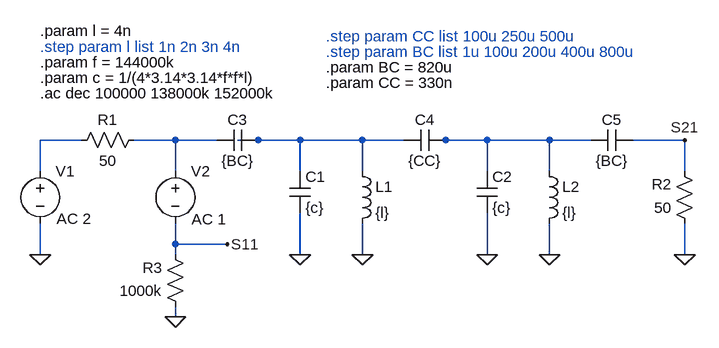
[diagram p0: schematic ece522p1.1.asc]
ece522p1.1.asc, the LTspice schematic file:
Version 4
SHEET 1 964 680
WIRE -240 112 -304 112
WIRE -96 112 -160 112
WIRE -32 112 -96 112
WIRE 32 112 0 112
WIRE 96 112 32 112
WIRE 192 112 96 112
WIRE 256 112 192 112
WIRE 320 112 304 112
WIRE 384 112 320 112
WIRE 480 112 384 112
WIRE 544 112 480 112
WIRE 688 112 608 112
WIRE -304 160 -304 112
WIRE -96 160 -96 112
WIRE 96 160 96 112
WIRE 192 160 192 112
WIRE 384 160 384 112
WIRE 480 160 480 112
WIRE 688 160 688 112
WIRE -96 272 -96 240
WIRE -16 272 -96 272
WIRE -304 288 -304 240
WIRE -96 288 -96 272
WIRE 96 288 96 224
WIRE 192 288 192 240
WIRE 384 288 384 224
WIRE 480 288 480 240
WIRE 688 288 688 240
WIRE -96 384 -96 368
WIRE -96 384 -112 384
FLAG -304 288 0
FLAG -96 384 0
FLAG 96 288 0
FLAG 192 288 0
FLAG 384 288 0
FLAG 688 288 0
FLAG 480 288 0
FLAG -16 272 S11
FLAG 688 112 S21
SYMBOL cap 80 160 R0
SYMATTR InstName C1
SYMATTR Value {c}
SYMBOL cap 368 160 R0
SYMATTR InstName C2
SYMATTR Value {c}
SYMBOL cap 32 96 R90
WINDOW 0 0 32 VBottom 2
WINDOW 3 32 32 VTop 2
SYMATTR InstName C3
SYMATTR Value {BC}
SYMBOL cap 320 96 R90
WINDOW 0 0 32 VBottom 2
WINDOW 3 32 32 VTop 2
SYMATTR InstName C4
SYMATTR Value {CC}
SYMBOL cap 608 96 R90
WINDOW 0 0 32 VBottom 2
WINDOW 3 32 32 VTop 2
SYMATTR InstName C5
SYMATTR Value {BC}
SYMBOL res -144 96 R90
WINDOW 0 0 56 VBottom 2
WINDOW 3 32 56 VTop 2
SYMATTR InstName R1
SYMATTR Value 50
SYMBOL res 704 256 R180
WINDOW 0 36 76 Left 2
WINDOW 3 36 40 Left 2
SYMATTR InstName R2
SYMATTR Value 50
SYMBOL res -80 384 R180
WINDOW 0 36 76 Left 2
WINDOW 3 36 40 Left 2
SYMATTR InstName R3
SYMATTR Value 1000k
SYMBOL ind 176 144 R0
SYMATTR InstName L1
SYMATTR Value {l}
SYMBOL ind 464 144 R0
SYMATTR InstName L2
SYMATTR Value {l}
SYMBOL voltage -304 144 R0
WINDOW 123 25 89 Left 2
WINDOW 39 0 0 Left 0
SYMATTR Value2 AC 2
SYMATTR InstName V1
SYMATTR Value ""
SYMBOL voltage -96 144 R0
WINDOW 123 25 90 Left 2
WINDOW 39 0 0 Left 0
SYMATTR Value2 AC 1
SYMATTR InstName V2
SYMATTR Value ""
TEXT -304 40 Left 2 !.ac dec 100000 138000k 152000k
TEXT -304 16 Left 2 !.param c = 1/(4*3.14*3.14*f*f*l)
TEXT -304 -8 Left 2 !.param f = 144000k
TEXT -304 -32 Left 2 ;.step param l list 1n 2n 3n 4n
TEXT -304 -56 Left 2 !.param l = 4n
TEXT 136 -48 Left 2 ;.step param CC list 100u 250u 500u
TEXT 136 -24 Left 2 ;.step param BC list 1u 100u 200u 400u 800u
TEXT 136 0 Left 2 !.param BC = 820u
TEXT 136 24 Left 2 !.param CC = 330n

The netlist it stands for:
* ece522p1.1.asc
C1 N003 0 {c}
C2 N004 0 {c}
C3 N003 N002 {BC}
C4 N004 N003 {CC}
C5 S21 N004 {BC}
R1 N002 N001 50
R2 0 S21 50
R3 0 S11 1000k
L1 N003 0 {l}
L2 N004 0 {l}
V1 N001 0 AC 2
V2 N002 S11 AC 1
.ac dec 100000 138000k 152000k
.param c = 1/(4*3.14*3.14*f*f*l)
.param f = 144000k
* .step param l list 1n 2n 3n 4n
.param l = 4n
* .step param CC list 100u 250u 500u
* .step param BC list 1u 100u 200u 400u 800u
.param BC = 820u
.param CC = 330n
.backanno
.end